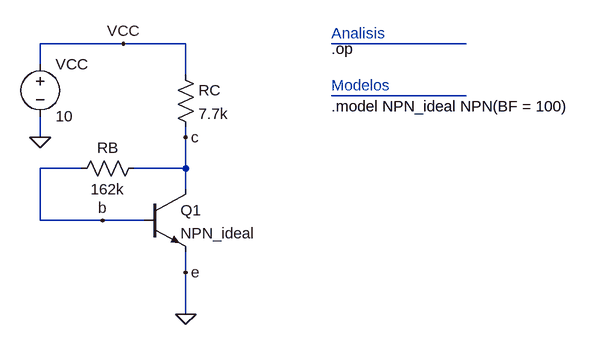
[diagram p0: schematic example3.asc]
example3.asc, the LTspice schematic file:
Version 4
SHEET 1 916 680
WIRE -384 -832 -512 -832
WIRE -288 -832 -384 -832
WIRE 144 -832 -64 -832
WIRE -512 -800 -512 -832
WIRE -288 -784 -288 -832
WIRE 144 -752 -64 -752
WIRE -512 -688 -512 -720
WIRE -288 -688 -288 -704
WIRE -448 -640 -512 -640
WIRE -288 -640 -288 -688
WIRE -288 -640 -368 -640
WIRE -288 -608 -288 -640
WIRE -512 -560 -512 -640
WIRE -416 -560 -512 -560
WIRE -352 -560 -416 -560
WIRE -288 -480 -288 -512
WIRE -288 -416 -288 -480
FLAG -512 -688 0
FLAG -288 -416 0
FLAG -416 -560 b
FLAG -288 -688 c
FLAG -288 -480 e
FLAG -384 -832 VCC
SYMBOL npn -352 -608 R0
SYMATTR InstName Q1
SYMATTR Value NPN_ideal
SYMBOL res -352 -656 R90
WINDOW 0 0 56 VBottom 2
WINDOW 3 32 56 VTop 2
SYMATTR InstName RB
SYMATTR Value 162k
SYMBOL res -304 -800 R0
SYMATTR InstName RC
SYMATTR Value 7.7k
SYMBOL voltage -512 -816 R0
WINDOW 123 0 0 Left 0
WINDOW 39 0 0 Left 0
SYMATTR InstName VCC
SYMATTR Value 10
TEXT -64 -848 Left 2 ;Analisis
TEXT -64 -824 Left 2 !.op
TEXT -64 -736 Left 2 !.model NPN_ideal NPN(BF = 100)
TEXT -64 -768 Left 2 ;Modelos

The netlist it stands for:
* example3.asc
Q1 c b 0 0 NPN_ideal
RB c b 162k
RC VCC c 7.7k
VCC VCC 0 10
.model NPN NPN
.model PNP PNP
.lib standard.bjt
* Analisis
.op
.model NPN_ideal NPN(BF = 100)
* Modelos
.backanno
.end

* Results of the author's LTspice run, read from the files saved beside the schematic
* Operating Point:
*   V(c) = 2.364 V
*   V(b) = 773.8 mV
*   V(vcc) = 10 V
*   Ic(Q1) = 981.8 µA
*   Ib(Q1) = 9.818 µA
*   Ie(Q1) = -991.7 µA
*   I(Rc) = 991.6 µA
*   I(Rb) = 9.818 µA
*   I(Vcc) = -991.6 µA
* From the log:
*   Semiconductor Device Operating Points:
*                           --- Bipolar Transistors ---
*   Name:       q1
*   Model:   npn_ideal
*   Ib:       9.82e-06
*   Ic:       9.82e-04
*   Vbe:      7.74e-01
*   Vbc:     -1.59e+00
*   Vce:      2.36e+00
*   BetaDC:   1.00e+02
*   Gm:       3.80e-02
*   Rpi:      2.63e+03
*   Rx:       0.00e+00
*   Ro:       1.32e+41
*   Cbe:      0.00e+00
*   Cbc:      0.00e+00
*   Cjs:      0.00e+00
*   BetaAC:   1.00e+02
*   Cbx:      0.00e+00
*   Ft:       0.00e+00